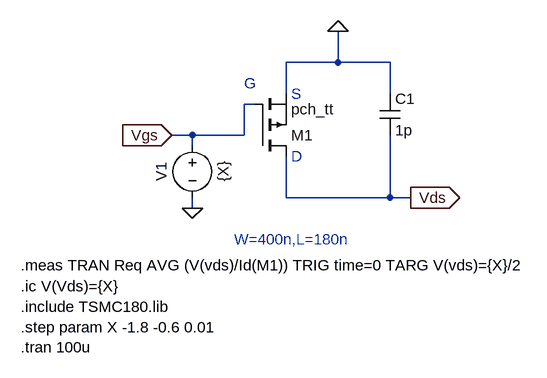
[diagram p0: schematic Prob_1b2.asc]
Prob_1b2.asc, the LTspice schematic file:
Version 4
SHEET 1 880 680
WIRE 384 -32 384 -80
WIRE 384 -32 304 -32
WIRE 464 -32 384 -32
WIRE 304 16 304 -32
WIRE 464 16 464 -32
WIRE 256 32 240 32
WIRE 160 80 128 80
WIRE 240 80 240 32
WIRE 240 80 160 80
WIRE 160 96 160 80
WIRE 304 176 304 112
WIRE 464 176 464 80
WIRE 464 176 304 176
WIRE 496 176 464 176
WIRE 160 192 160 176
FLAG 128 80 Vgs
IOPIN 128 80 In
FLAG 160 192 0
FLAG 384 -80 0
FLAG 496 176 Vds
IOPIN 496 176 Out
SYMBOL voltage 160 80 R0
WINDOW 0 -32 56 VBottom 2
WINDOW 3 32 56 VTop 2
WINDOW 123 0 0 Left 0
WINDOW 39 0 0 Left 0
SYMATTR InstName V1
SYMATTR Value {X}
SYMBOL cap 448 16 R0
SYMATTR InstName C1
SYMATTR Value 1p
SYMBOL pmos 256 112 M180
SYMATTR InstName M1
SYMATTR Value pch_tt
SYMATTR Value2 W=400n, L=180n
TEXT -104 344 Left 2 !.include TSMC180.lib\n.step param X -1.8 -0.6 0.01\n.tran 100u
TEXT -104 312 Left 2 !.ic V(Vds)={X}
TEXT -104 280 Left 2 !.meas TRAN Req AVG (V(vds)/Id(M1)) TRIG time=0 TARG V(vds)={X}/2
TEXT 224 240 Left 2 ;W=400n,L=180n
TEXT 240 0 Left 2 ;G
TEXT 312 16 Left 2 ;S
TEXT 312 112 Left 2 ;D

The netlist it stands for:
* Prob_1b2.asc
V1 Vgs 0 {X}
C1 0 Vds 1p
M1 Vds Vgs 0 0 pch_tt W=400n, L=180n
.model NMOS NMOS
.model PMOS PMOS
.lib standard.mos
.include TSMC180.lib
.step param X -1.8 -0.6 0.01
.tran 100u
.ic V(Vds)={X}
.meas TRAN Req AVG (V(vds)/Id(M1)) TRIG time=0 TARG V(vds)={X}/2
* W=400n,L=180n
* G
* S
* D
.backanno
.end

* Results of the author's LTspice run, read from the files saved beside the schematic
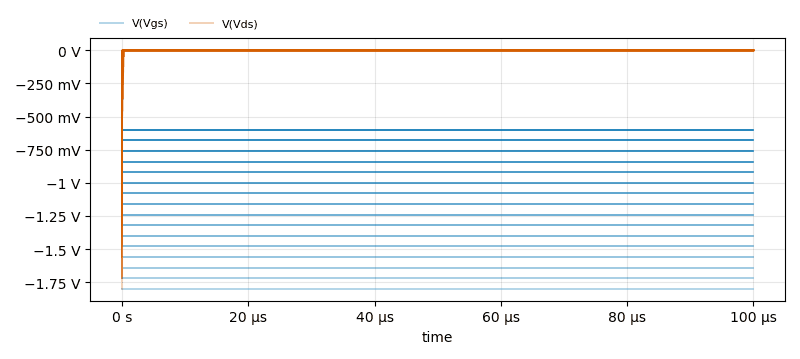
[diagram p1: Transient Analysis of Prob_1b2.asc, plotted from the saved traces]
* Transient Analysis, 121 runs:
*   V(Vgs) [run 1]: min -1.8 V, max -1.8 V, average -1.8 V, rms 1.8 V, last -1.8 V
*   V(Vgs) [run 2]: min -1.72 V, max -1.72 V, average -1.72 V, rms 1.72 V, last -1.72 V
*   V(Vgs) [run 3]: min -1.64 V, max -1.64 V, average -1.64 V, rms 1.64 V, last -1.64 V
*   V(Vgs) [run 4]: min -1.56 V, max -1.56 V, average -1.56 V, rms 1.56 V, last -1.56 V
*   V(Vgs) [run 5]: min -1.48 V, max -1.48 V, average -1.48 V, rms 1.48 V, last -1.48 V
*   V(Vgs) [run 6]: min -1.4 V, max -1.4 V, average -1.4 V, rms 1.4 V, last -1.4 V
*   V(Vgs) [run 7]: min -1.32 V, max -1.32 V, average -1.32 V, rms 1.32 V, last -1.32 V
*   V(Vgs) [run 8]: min -1.24 V, max -1.24 V, average -1.24 V, rms 1.24 V, last -1.24 V
*   V(Vds) [run 1]: min -1.8 V, max 0 V, average -175.2 µV, rms 13.71 mV, last 0 V
*   V(Vds) [run 2]: min -1.72 V, max 0 V, average -176.2 µV, rms 13.45 mV, last 0 V
*   V(Vds) [run 3]: min -1.64 V, max 0 V, average -178.1 µV, rms 13.22 mV, last 0 V
*   V(Vds) [run 4]: min -1.56 V, max 0 V, average -180.9 µV, rms 13.02 mV, last 0 V
*   V(Vds) [run 5]: min -1.48 V, max 0 V, average -184.9 µV, rms 12.85 mV, last 0 V
*   V(Vds) [run 6]: min -1.4 V, max 0 V, average -191 µV, rms 12.77 mV, last 0 V
*   V(Vds) [run 7]: min -1.32 V, max 0 V, average -195.3 µV, rms 12.54 mV, last 0 V
*   V(Vds) [run 8]: min -1.24 V, max 0 V, average -201.8 µV, rms 12.36 mV, last 0 V
* From the log:
*   Measurement: req
*     step  AVG(v(vds)/id(m1))  FROM  TO
*        1  9844.32  0  1.67475e-008
*        2  9912.01  0  1.68142e-008
*        3  9981.14  0  1.68823e-008
*        4  10053.4  0  1.69521e-008
*        5  10127.9  0  1.70236e-008
*        6  10204.1  0  1.70967e-008
*        7  10281.8  0  1.71716e-008
*        8  10361.3  0  1.72482e-008
*        9  10442.5  0  1.73266e-008
*       10  10525.5  0  1.74068e-008
*       11  10610.4  0  1.74889e-008
*       12  10697.1  0  1.75728e-008
*       13  10785.8  0  1.76586e-008
*       14  10876.5  0  1.77465e-008
*       15  10969.2  0  1.78364e-008
*       16  11064.1  0  1.79284e-008
*       17  11161.2  0  1.80224e-008
*       18  11260.6  0  1.81185e-008
*       19  11362.4  0  1.82166e-008
*       20  11466.6  0  1.83169e-008
*       21  11573.2  0  1.84203e-008
*       22  11682.3  0  1.85263e-008
*       23  11794.2  0  1.86342e-008
*       24  11908.9  0  1.87441e-008
*       25  12026.7  0  1.88561e-008
*       26  12147.6  0  1.897e-008
*       27  12271.8  0  1.90859e-008
*       28  12399.3  0  1.92038e-008
*       29  12530.5  0  1.93236e-008
*       30  12665.4  0  1.94452e-008
*       31  12804.3  0  1.95687e-008
*       32  12947.4  0  1.96938e-008
*       33  13094.9  0  1.98206e-008
*       34  13247.1  0  1.99488e-008
*       35  13404.2  0  2.00784e-008
*       36  13566.7  0  2.02092e-008
*       37  13734.9  0  2.03409e-008
*       38  13909.2  0  2.04734e-008
*       39  14090  0  2.06062e-008
*       40  14296.1  0  2.06486e-008
*     ...